# Altium schematic sheet Nuio_LeftKeyboard_Rev_E_5_KeyboardNRF.SchDoc: Nuio - Left Keyboard + nRF
size B; Organization: OLogic, Inc.; SheetNumber: 5; SheetTotal: 5; PageSetup: Record=PageOptions|CenterHorizontal=True|CenterVertical=True|PrintScale=0.95|XCorrection=1.00|YCorrection=1.00|PrintKind=1|BorderSize=5000000|LeftOffset=0|BottomOffset=0|Orientation=2|PaperLength=1000|PaperWidth=1000|Scale=100|PaperSource=7|PrintQuality=-4|MediaType=1|DitherType=10|PaperKind=Letter|PrintScaleMode=1
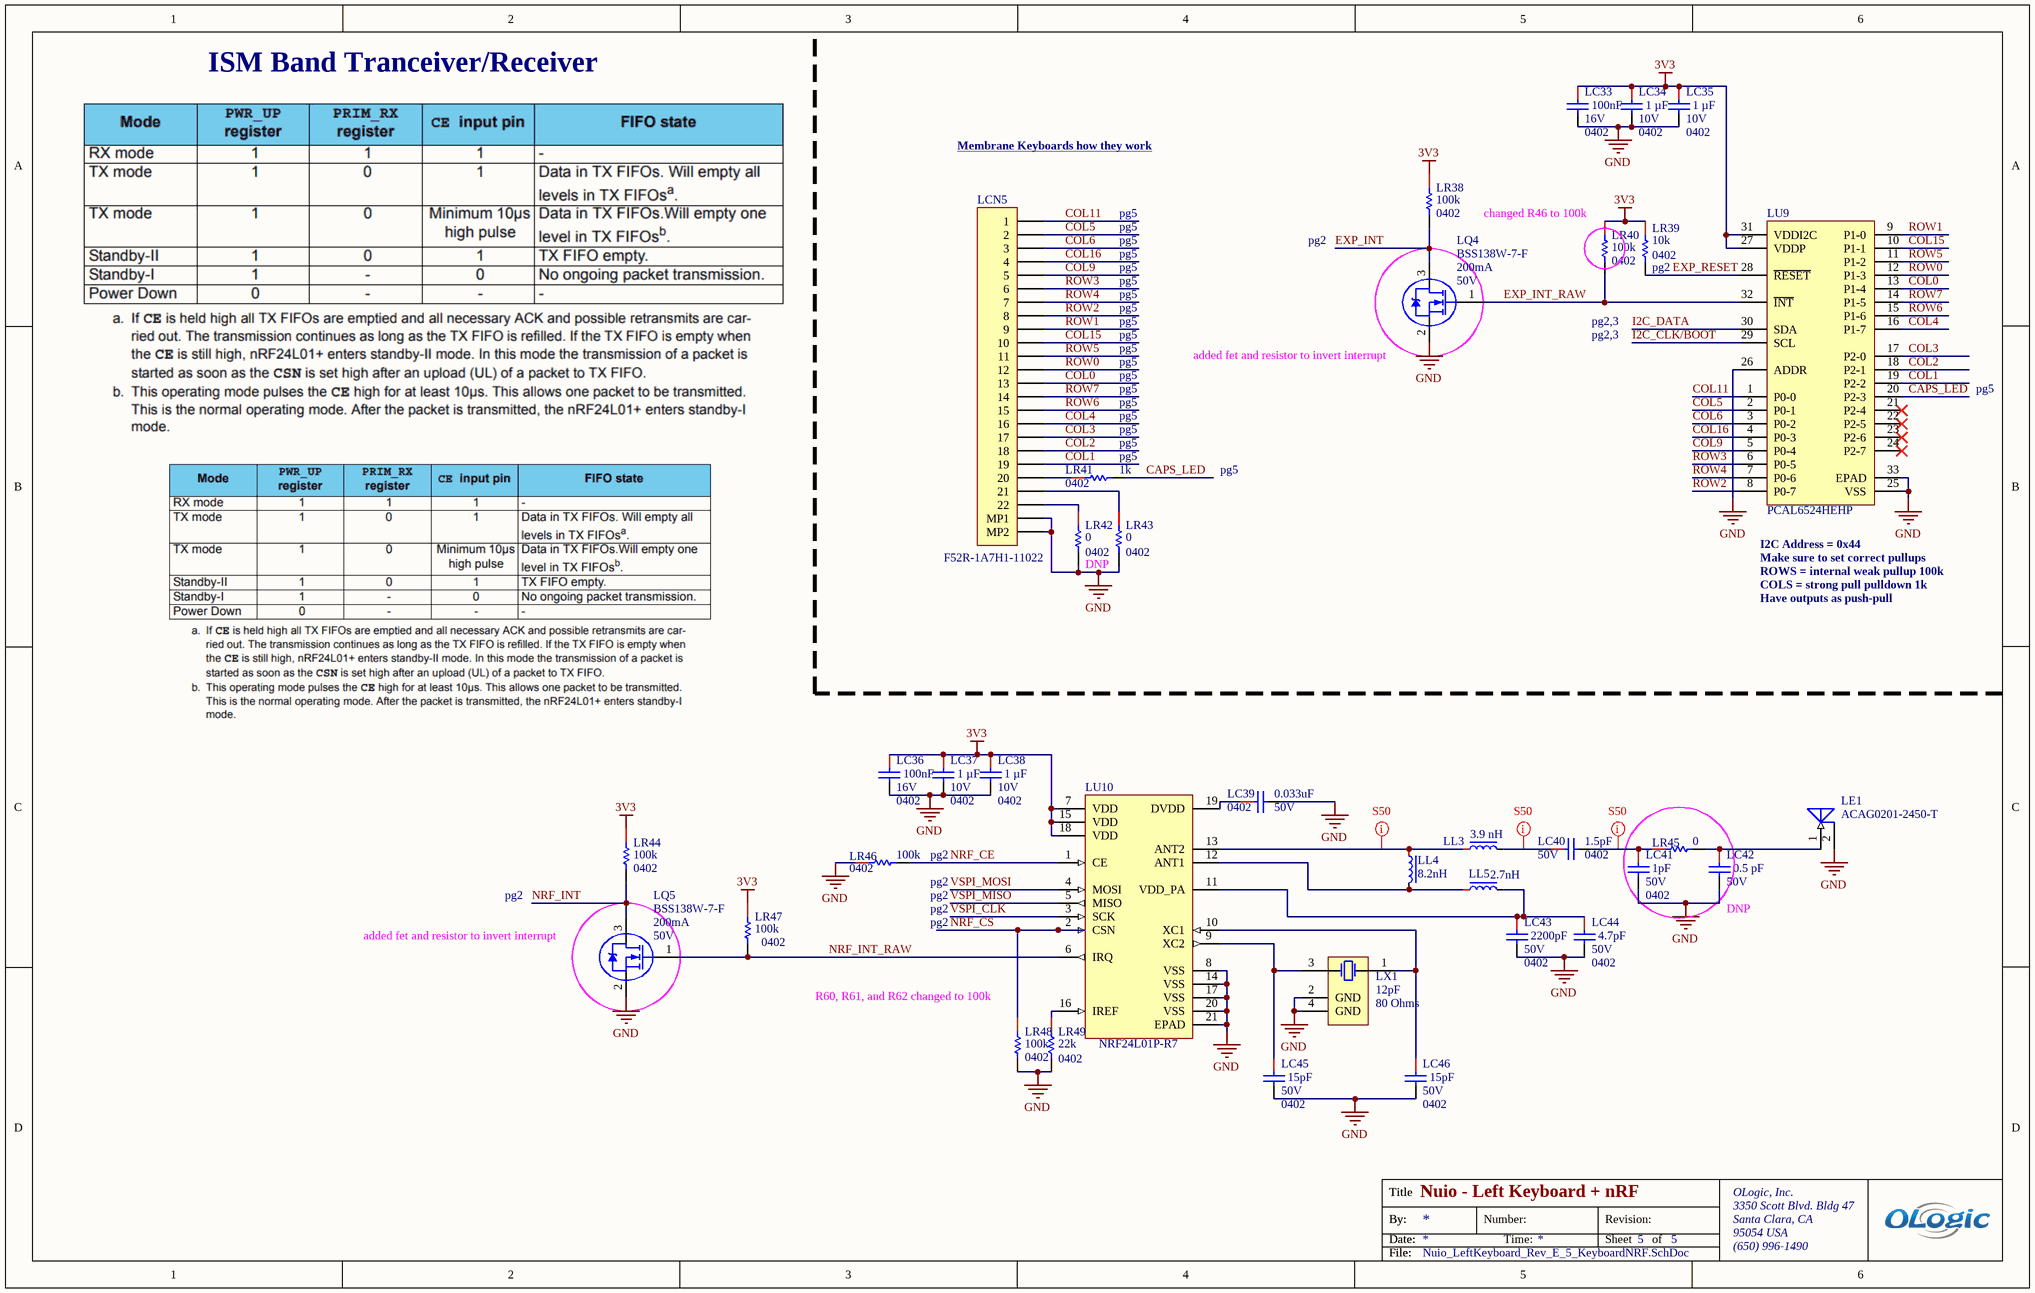
[diagram p0: Nuio_LeftKeyboard_Rev_E_5_KeyboardNRF.SchDoc]

## Parts
LC33  Package (Imperial): 0402  Voltage (Rated): 16V  Capacitance: 100nF  [CAPC0402(1005)_L]  (hidden comment: CAP CER 0.1UF 16V X5R 0402)
LC34  Package (Imperial): 0402  Voltage (Rated): 10V  Capacitance: 1 µF  [CAPC0402(1005)_L]  (hidden comment: CAP CER 1UF 10V X5R 0402)
LC35  Package (Imperial): 0402  Voltage (Rated): 10V  Capacitance: 1 µF  [CAPC0402(1005)_L]  (hidden comment: CAP CER 1UF 10V X5R 0402)
LC36  Package (Imperial): 0402  Voltage (Rated): 16V  Capacitance: 100nF  [CAPC0402(1005)_L]  (hidden comment: CAP CER 0.1UF 16V X5R 0402)
LC37  Package (Imperial): 0402  Voltage (Rated): 10V  Capacitance: 1 µF  [CAPC0402(1005)_L]  (hidden comment: CAP CER 1UF 10V X5R 0402)
LC38  Package (Imperial): 0402  Voltage (Rated): 10V  Capacitance: 1 µF  [CAPC0402(1005)_L]  (hidden comment: CAP CER 1UF 10V X5R 0402)
LC39  0.033uF  Voltage (Rated): 50V  Package (Imperial): 0402  [CAPC0402(1005)_L]
LC40  1.5pF  Voltage (Rated): 50V  Package (Imperial): 0402  [CAPC0402(1005)_L]
LC41  1pF  Voltage (Rated): 50V  Package (Imperial): 0402  [CAPC0402(1005)_L]
LC42  Capacitance: 0.5 pF  Voltage - Rated: 50V  [CAPC0402(1005)_L]  (hidden comment: CAP CER 0.5PF 50V C0G/NP0 0402)  (no BOM)
LC43  2200pF  Voltage (Rated): 50V  Package (Imperial): 0402  [CAPC0402(1005)_L]
LC44  4.7pF  Voltage (Rated): 50V  Package (Imperial): 0402  [CAPC0402(1005)_L]
LC45  15pF  Voltage (Rated): 50V  Package (Imperial): 0402  [CAPC0402(1005)_L]
LC46  15pF  Voltage (Rated): 50V  Package (Imperial): 0402  [CAPC0402(1005)_L]
LCN5  F52R-1A7H1-11022  [F52R-1A7H1-11022]
LE1  ACAG0201-2450-T  [ACAG0201-2450-T]
LL3  Inductance: 3.9 nH  [FP-LQG15HH_02-IPC_C]  (hidden comment: FIXED IND 3.9NH 0402)
LL4  Inductance: 8.2nH  [Inductor0402(1005)_L]  (hidden comment: FIXED IND 8.2NH 550MA 240MOHM SM)
LL5  Inductance: 2.7nH  [Inductor0402(1005)_L]  (hidden comment: FIXED IND 2.7NH 800MA 150MOHM SM)
LQ4  BSS138W-7-F  Continuous Drain Current (ID): 200mA  Voltage Rating (DC): 50V  [DIOD-SOT323-3_V]
LQ5  BSS138W-7-F  Continuous Drain Current (ID): 200mA  Voltage Rating (DC): 50V  [DIOD-SOT323-3_V]
LR38  value 100k  Case Code (Imperial): 0402  [RESC0402(1005)_L]  (hidden comment: RES 100K OHM 1% 1/16W 0402)
LR39  Package (Imperial): 0402  Resistance: 10k  [RESC0402(1005)_L]  (hidden comment: RES SMD 10K OHM 1% 1/16W 0402)
LR40  value 100k  Case Code (Imperial): 0402  [RESC0402(1005)_L]  (hidden comment: RES 100K OHM 1% 1/16W 0402)
LR41  Resistance: 1k  Package (Imperial): 0402  [RESC0402(1005)_L]  (hidden comment: RES SMD 1K OHM 1% 1/16W 0402)
LR42  Package (Imperial): 0402  Resistance: 0  [RESC0402(1005)_L]  (hidden comment: RES 0 OHM JUMPER 1/16W 0402)  (no BOM)
LR43  Package (Imperial): 0402  Resistance: 0  [RESC0402(1005)_L]  (hidden comment: RES 0 OHM JUMPER 1/16W 0402)
LR44  value 100k  Case Code (Imperial): 0402  [RESC0402(1005)_L]  (hidden comment: RES 100K OHM 1% 1/16W 0402)
LR45  Resistance: 0  [RESC0402(1005)_L]  (hidden comment: RES 0 OHM JUMPER 1/16W 0402)
LR46  value 100k  Case Code (Imperial): 0402  [RESC0402(1005)_L]  (hidden comment: RES 100K OHM 1% 1/16W 0402)
LR47  value 100k  Case Code (Imperial): 0402  [RESC0402(1005)_L]  (hidden comment: RES 100K OHM 1% 1/16W 0402)
LR48  value 100k  Case Code (Imperial): 0402  [RESC0402(1005)_L]  (hidden comment: RES 100K OHM 1% 1/16W 0402)
LR49  Package (Imperial): 0402  [RESC0402(1005)_L]  (hidden comment: 22K)
LU9  PCAL6524HEHP  [QFN50P500X500X60_HS-33N]
LU10  NRF24L01P-R7  [QFN50P400X400X95_HS-21N]
LX1  Load Capacitance: 12pF  ESR: 80 Ohms  [ECS-160-12-33-AGN-TR3]  (hidden comment: ECS-160-12-33-AGN-TR3)

## Nets
3V3: LC33.1 LC34.1 LC35.1 LC36.1 LC37.1 LC38.1 LR38.1 LR39.1 LR40.1 LR44.1 LR47.1 LU9.27(VDDP) LU9.31(VDDI2C) LU10.7(VDD) LU10.15(VDD) LU10.18(VDD)
GND: LC33.2 LC34.2 LC35.2 LC36.2 LC37.2 LC38.2 LC39.2 LC41.2 LC42.2 LC43.2 LC44.2 LC45.2 LC46.2 LCN5.MP1 LCN5.MP2 LE1.2(GND) LQ4.2(S) LQ5.2(S) LR42.2 LR43.2 LR46.1 LR48.2 LR49.2 LU9.25(VSS) LU9.26(ADDR) LU9.33(EPAD) LU10.8(VSS) LU10.14(VSS) LU10.17(VSS) LU10.20(VSS) LU10.21(EPAD) LX1.2(GND) LX1.4(GND)
CAPS_LED: LR41.2 LU9.20(P2-3)
COL0: LCN5.13 LU9.13(P1-4)
COL1: LCN5.19 LU9.19(P2-2)
COL2: LCN5.18 LU9.18(P2-1)
COL3: LCN5.17 LU9.17(P2-0)
COL4: LCN5.16 LU9.16(P1-7)
COL5: LCN5.2 LU9.2(P0-1)
COL6: LCN5.3 LU9.3(P0-2)
COL9: LCN5.5 LU9.5(P0-4)
COL11: LCN5.1 LU9.1(P0-0)
COL15: LCN5.10 LU9.10(P1-1)
COL16: LCN5.4 LU9.4(P0-3)
EXP_INT: LQ4.3(D) LR38.2
EXP_INT_RAW: LQ4.1(G) LR40.2 LU9.32(~{INT})
EXP_RESET: LR39.2 LU9.28(~{RESET})
I2C_CLK/BOOT: LU9.29(SCL)
I2C_DATA: LU9.30(SDA)
NRF_CE: LR46.2 LU10.1(CE)
NRF_CS: LR48.1 LU10.2(CSN)
NRF_INT: LQ5.3(D) LR44.2
NRF_INT_RAW: LQ5.1(G) LR47.2 LU10.6(IRQ)
ROW0: LCN5.12 LU9.12(P1-3)
ROW1: LCN5.9 LU9.9(P1-0)
ROW2: LCN5.8 LU9.8(P0-7)
ROW3: LCN5.6 LU9.6(P0-5)
ROW4: LCN5.7 LU9.7(P0-6)
ROW5: LCN5.11 LU9.11(P1-2)
ROW6: LCN5.15 LU9.15(P1-6)
ROW7: LCN5.14 LU9.14(P1-5)
VSPI_CLK: LU10.3(SCK)
VSPI_MISO: LU10.5(MISO)
VSPI_MOSI: LU10.4(MOSI)
NetLC39_1: LC39.1 LU10.19(DVDD)
NetLC40_1: LC40.1 LL3.2
NetLC40_2: LC40.2 LC41.1 LR45.1
NetLC42_1: LC42.1 LE1.1(INPUT) LR45.2
NetLC43_1: LC43.1 LC44.1 LL5.2 LU10.11(VDD_PA)
NetLC45_1: LC45.1 LU10.9(XC2) LX1.3(OSC2)
NetLC46_1: LC46.1 LU10.10(XC1) LX1.1(OSC1)
NetLCN5_20: LCN5.20 LR41.1
NetLCN5_21: LCN5.21 LR43.1
NetLCN5_22: LCN5.22 LR42.1
NetLL3_1: LL3.1 LL4.1 LU10.13(ANT2)
NetLL4_2: LL4.2 LL5.1 LU10.12(ANT1)
NetLR49_1: LR49.1 LU10.16(IREF)

Not connected (* = marked no-connect by the designer): LU9 21(P2-4)* 22(P2-5)* 23(P2-6)* 24(P2-7)*

## Layout directives
net class S50: NetLC40_1, NetLC40_2, NetLL3_1

## Notes on the sheet
- ISM Band Tranceiver/Receiver
- Membrane Keyboards how they work <https://lastminuteengineers.com/arduino-keypad-tutorial/>
- pg5
- (near LR40) changed R46 to 100k
- pg2
- (near LR39) pg2
- (near LQ4) added fet and resistor to invert interrupt
- pg2,3
- (near LR41) pg5
- DNP
- (near LU9) I2C Address = 0x44
- Make sure to set correct pullups
- Have outputs as push-pull
- ROWS = internal weak pullup 100k
- COLS = strong pull pulldown 1k
- (near LR46) pg2
- (near LC42) DNP
- (near LQ5) added fet and resistor to invert interrupt
- (near LR48) R60, R61, and R62 changed to 100k
- Title
- By:
- Date:
- Number:
- Time:
- Revision:
- Sheet
- of
- OLogic, Inc.
- 3350 Scott Blvd. Bldg 47
- Santa Clara, CA
- 95054 USA
- File:
- (650) 996-1490

## Library data of the parts
LC33 LC36 = CMP-001-0605-23: ±10% 16V Ceramic Capacitor X5R 0402 (1005 Metric); Manufacturer: Taiyo Yuden; Manufacturer Part Number: EMK105BJ104KV-F; Package (Metric): 1005; Temperature (Max): 85°C; Temperature (Min): -55°C; Height: 550µm; Supplier: Digi-Key; Supplier Part Number: 587-1226-1-ND; Tolerance: 10%; Dielectric Material: Ceramic; Temperature Coefficient: X5R; Width: 500µm; Length: 1mm; Mounting Type: SMD
LC34 LC35 LC37 LC38 = CMP-001-1453-04: ±20% 10V Ceramic Capacitor X5R 0402 (1005 Metric); Manufacturer Part Number: CC0402MRX5R6BB105; Manufacturer: Yageo; Supplier: Digi-Key; Tolerance: ±20%; Supplier Part Number: 311-1732-1-ND; Temperature Coefficient: X5R; Height: 0.55mm
LC39 = CMP-007-0031-14: CAP CER 0.033UF 50V 10% X7R 0402; Package (Metric): 1005; Capacitance: 33nF; Dielectric Material: Ceramic; Mounting Type: SMD; Tolerance: 10%; Temperature Coefficient: X7R
LC40 = CMP-007-0063-14: CAP CER 1.5PF 50V NP0 0402; Tolerance: 5%; Temperature Coefficient: C0G, NP0; Dielectric Material: Ceramic; Package (Metric): 1005; Mounting Type: SMD; Capacitance: 1.5pF
LC41 = CMP-007-0102-14: CAP CER 1PF 50V NP0 0402; Temperature Coefficient: C0G, NP0; Tolerance: 5%; Dielectric Material: Ceramic; Package (Metric): 1005; Mounting Type: SMD; Capacitance: 1pF
LC42 = CMP-001-2177-04: 0.5 pF ±0.1pF 50V Ceramic Capacitor C0G, NP0 0402 (1005 Metric); Manufacturer Part Number: QSCF500Q0R5B1GV001T; Manufacturer: Johanson Technology Inc.; Temperature Coefficient: C0G, NP0; Operating Temperature: -55°C ~ 125°C; Tolerance: ±0.1pF; Applications: RF, Microwave, High Frequency; Features: High Q, Low Loss, Ultra Low ESR; RoHS Compliant: Yes; Size / Dimension: 0.040" L x 0.020" W (1.02mm x 0.51mm); Thickness (Max): 0.024" (0.61mm)
LC43 = CMP-007-0123-17: CAP CER 2200PF 50V 10% X7R 0402; Capacitance: 2.2nF; Dielectric Material: Ceramic; Package (Metric): 1005; Tolerance: 10%; Temperature Coefficient: X7R; Mounting Type: SMD
LC44 = CMP-001-2014-06: CAP CER 4.7pF 50V 5% NP0 0402; Dielectric Material: Ceramic; Package (Metric): 1005; Length: 1mm; Tolerance: 5%; Capacitance: 4.7pF; Width: 500µm; Dielectric: Ceramic; Mounting Type: SMD; Temperature Coefficient: NP0
LC45 LC46 = CMP-007-0098-14: CAP CER 15PF 50V C0G/NP0 0402; Temperature Coefficient: C0G, NP0; Package (Metric): 1005; Tolerance: 5%; Dielectric Material: Ceramic; Mounting Type: SMD; Capacitance: 15pF
LCN5 = CMP-001-2003-02: FLEX CONNECTOR, 1.00MM PITCH, HE; Manufacturer: Amphenol ICC (FCI); Voltage Rating: 50V; Current Rating: 0.5A; Flat Flex Type: FFC, FPC; Number of Positions: 22; Manufacturer Part Number: F52R-1A7H1-11022; Mounting Type: SND, Right Angle
LE1 = CMP-001-2000-02: RF ANT 2.4GHZ CHIP SOLDER SMD; Manufacturer: Abracon LLC; VSWR: 2; Number of Bands: 1; RF Family: Bluetooth, General ISM, WiFi; Frequency Group: UHF; Mounting Type: SMD; Manufacturer Part Number: ACAG0201-2450-T; Frequency: 2.4GHz
LL3 = CMP-001-1524-02: Inductor RF Chip 0.0039uH 0.1nH 100MHz 8Q-Factor Air 0.75A 0.14Ohm DCR 0402 T/R; Manufacturer Part Number: Murata Electronics; Manufacturer: LQG15HS3N9B02D; Current: 750 mA; DC Resistance (DCR): 140mOhm Max; Inductance Frequency: 100 MHz; Tolerance: ±0.1nH; Height: 0.55mm; Package: 0402 (1005 Metric); RoHS Compliant: Yes; Size / Dimension: 0.039" L x 0.020" W (1.00mm x 0.50mm)
LL4 = CMP-001-2001-02: 8.2 nH Unshielded Multilayer Inductor 550 mA 240mOhm Max 0402 (1005 Metric); Manufacturer Part Number: LQG15HS8N2J02D; Manufacturer: Murata Electronics; DC Resistance (DCR): 240mR; Core Material: Air; Test Frequency: 100MHz; Self Resonant Frequency: 3.7GHz; Tolerance: 5%; Series: LQG15; Case/Package: 0402; Shielding: Unshielded; Mount: Surface Mount; Ratings: AEC-Q200; Max Operating Temperature: 125°C; Min Operating Temperature: -55°C; RoHS Compliant: Yes
LL5 = CMP-001-2002-02: 2.7 nH Unshielded Multilayer Inductor 800 mA 150mOhm Max 0402 (1005 Metric); Manufacturer Part Number: LQG15HS2N7S02D; Manufacturer: Murata Electronics; Test Frequency: 100MHz; Q Factor: 8; Rated Current-Max: 300mA; DC Resistance (DCR): 150mR; Core Material: Air; Self Resonant Frequency: 6GHz; Series: LQG15HS; RoHS Compliant: Yes; Width: 0.02inch; Height - Seated (Max): 0.022inch; Termination: SMD/SMT; Height: 0.5mm; Shielding: Unshielded; Min Operating Temperature: -55°C; Current Rating: 300mA; Case/Package: 0402; DC Current: 300mA; Depth: 0.55mm; Lead Free: Lead Free; Radiation Hardening: No; Mount: Surface Mount; Max DC Current: 300mA; Length: 1mm; Military Standard: Not; Max Operating Temperature: 125°C
LQ4 LQ5 = CMP-00300-01: DIODES INC. - BSS138W-7-F. - BSS FAMILY SOT323 T&R 3K ROHS COMPLIANT: YES; Manufacturer: Diodes Incorporated; Power: 200mW; Number of Channels: 1; Drain to Source Breakdown Voltage: 75V; Element Configuration: Single; Turn-On Delay Time: 20ns; Gate to Source Voltage (Vgs): 20V; Threshold Voltage: 1.2V; Input Capacitance: 50pF; On-State Resistance: 3.5R; Polarity: N-CHANNEL; Drain to Source Resistance: 1.4R; Voltage: 50V; Manufacturer Part Number: BSS138W-7-F; Current Rating: 200mA; Drain to Source Voltage (Vdss): 50V; Number of Elements: 1; Lead Free: Lead Free; Min Operating Temperature: -55°C; Max Operating Temperature: 150°C; Nominal Vgs: 1.2V; Packaging: Tape and Reel; Drain-source On Resistance-Max: 3.5R; Width: 1.35mm; Termination: SMD/SMT; Rds On Max: 3.5R; Height: 1mm; REACH SVHC: No SVHC; Package Quantity: 3000; Case/Package: SOT-323; Contact Plating: Tin,Matte; RoHS Compliant: Yes; Length: 2.2mm; Number of Pins: 3; Mount: Surface Mount; Weight: 0.000212oz; Turn-Off Delay Time: 20ns; Series: -; Dual Supply Voltage: 50V; Max Power Dissipation: 200mW
LR38 LR40 LR44 LR46-LR48 = CMP-007-0354-15: ±1% 0.063W, 1/16W Chip Resistor 0402 (1005 Metric) Moisture Resistant Thick Film; Manufacturer: YAGEO; Manufacturer Part Number: RC0402FR-07100KL; Max Power Dissipation: 63mW; Temperature Coefficient: 100ppm/°C; Voltage Rating: 50V; Case/Package: 0402; Construction: Rectangular; Depth: 0.5mm; Features: Moisture Resistant; Height: 0.016inch; Lead Free: Lead Free; Length: 0.039inch; Max Operating Temperature: 155°C; Military Standard: Not; Min Operating Temperature: -55°C; Power Rating: 63mW; Reach SVHC Compliant: No; Resistance Tolerance: 1%; Resistor Type: Thick Film; RoHS Compliant: Yes; Series: RC; Termination: SMD/SMT; Tolerance: 1%; Width: 0.02inch
LR39 = CMP-007-0358-16: 10 kOhms ±1% 0.063W, 1/16W Chip Resistor 0402 (1005 Metric) Thin Film; Package (Metric): 1005; Power: 63mW; Length: 1mm; Max Operating Temperature: 155°C; Termination: SMD/SMT; Width: 500µm; Min Operating Temperature: -55°C; Tolerance: 1%; Height: 400µm
LR41 = CMP-007-0405-16: 1k ±1% 0.063W, 1/16W Chip Resistor 0402 (1005 Metric) Moisture Resistant Thick FilmRES 1K OHM 1% 1/16W 0402; Manufacturer: Yageo; Manufacturer Part Number: RC0402FR-071KL; Power: 63mW; Package (Metric): 1005; Temperature Coefficient: 100ppm/°C; Supplier Part Number: 311-1.00KLRCT-ND; Supplier: Digi-Key; Height: 400µm; Termination: SMD/SMT; Composition: Thick Film; Width: 500µm; Tolerance: 1%
LR42 LR43 = CMP-007-0298-18: 0 Ohms Jumper Chip Resistor 0402 (1005 Metric) Automotive AEC-Q200 Thick Film; Manufacturer: Stackpole Electronics Inc; Manufacturer Part Number: RMCF0402ZT0R00; Package (Metric): 1005; Power: 63mW; Tolerance: 0%; Termination: SMD/SMT; Operating Temperature: -55°C ~ 155°C; Height: 400µm; Length: 1mm
LR45 = CMP-007-0298-18: 0 Ohms Jumper Chip Resistor 0402 (1005 Metric) Automotive AEC-Q200 Thick Film; Manufacturer: Stackpole Electronics Inc; Manufacturer Part Number: RMCF0402ZT0R00; Package (Imperial): 0402; Package (Metric): 1005; Power: 63mW; Tolerance: 0%; Termination: SMD/SMT; Operating Temperature: -55°C ~ 155°C; Height: 400µm; Length: 1mm
LR49 = CMP-00082-14: RES SMD 22K OHM 1% 1/16W 0402; Package (Metric): 1005; Power: 63mW; Length: 1mm; Resistance: 22k; Termination: SMD/SMT; Height: 400µm; Tolerance: 1%
LU9 = CMP-001-2076-03: Ultra low-voltage translating 24-bit Fm+ I²C-bus/SMBus I/O expander; Interface: I2C; Number of I/Os: 24; Frequency: 1MHz; RoHS Compliant: Yes; Mount: Surface Mount; Packaging: Tape and Reel; Min Operating Temperature: -40°C; Series: -; Max Operating Temperature: 85°C
LU10 = CMP-001-1993-05: IC RF TXRX ISM>1GHZ 20VFQFN; Manufacturer: Nordic Semiconductor ASA; Frequency: 2.4GHz; Max Supply Voltage: 3.6V; Current - Receiving: 13.5mA; Current - Transmitting: 11.3mA; Data Rate: 2Mbps; Output Power (dBm): 0dBm; Interface: SPI; Sensitivity: -94dBm; Length: 4mm; Packaging: Tape and Reel; Series: -; Case/Package: QFN; Package Quantity: 1500; Depth: 4mm; Min Operating Temperature: -40°C; Manufacturer Part Number: NRF24L01P-R7; Mount: Surface Mount; Max Operating Temperature: 85°C
LX1 = CMP-001-2112-01: CRYSTAL 16.0000MHZ 12PF SMD; Manufacturer: ECS Inc.; Frequency: 16MHz; Frequency Stability: +-30ppm; Frequency Tolerance: +-25ppm; Manufacturer Part Number: ECS-160-12-33-AGN-TR3; Package/Case: 4-SMD; Height: 0.8mm